# Altium schematic sheet radio.SchDoc
size A4; SheetNumber: 1; SheetTotal: 1
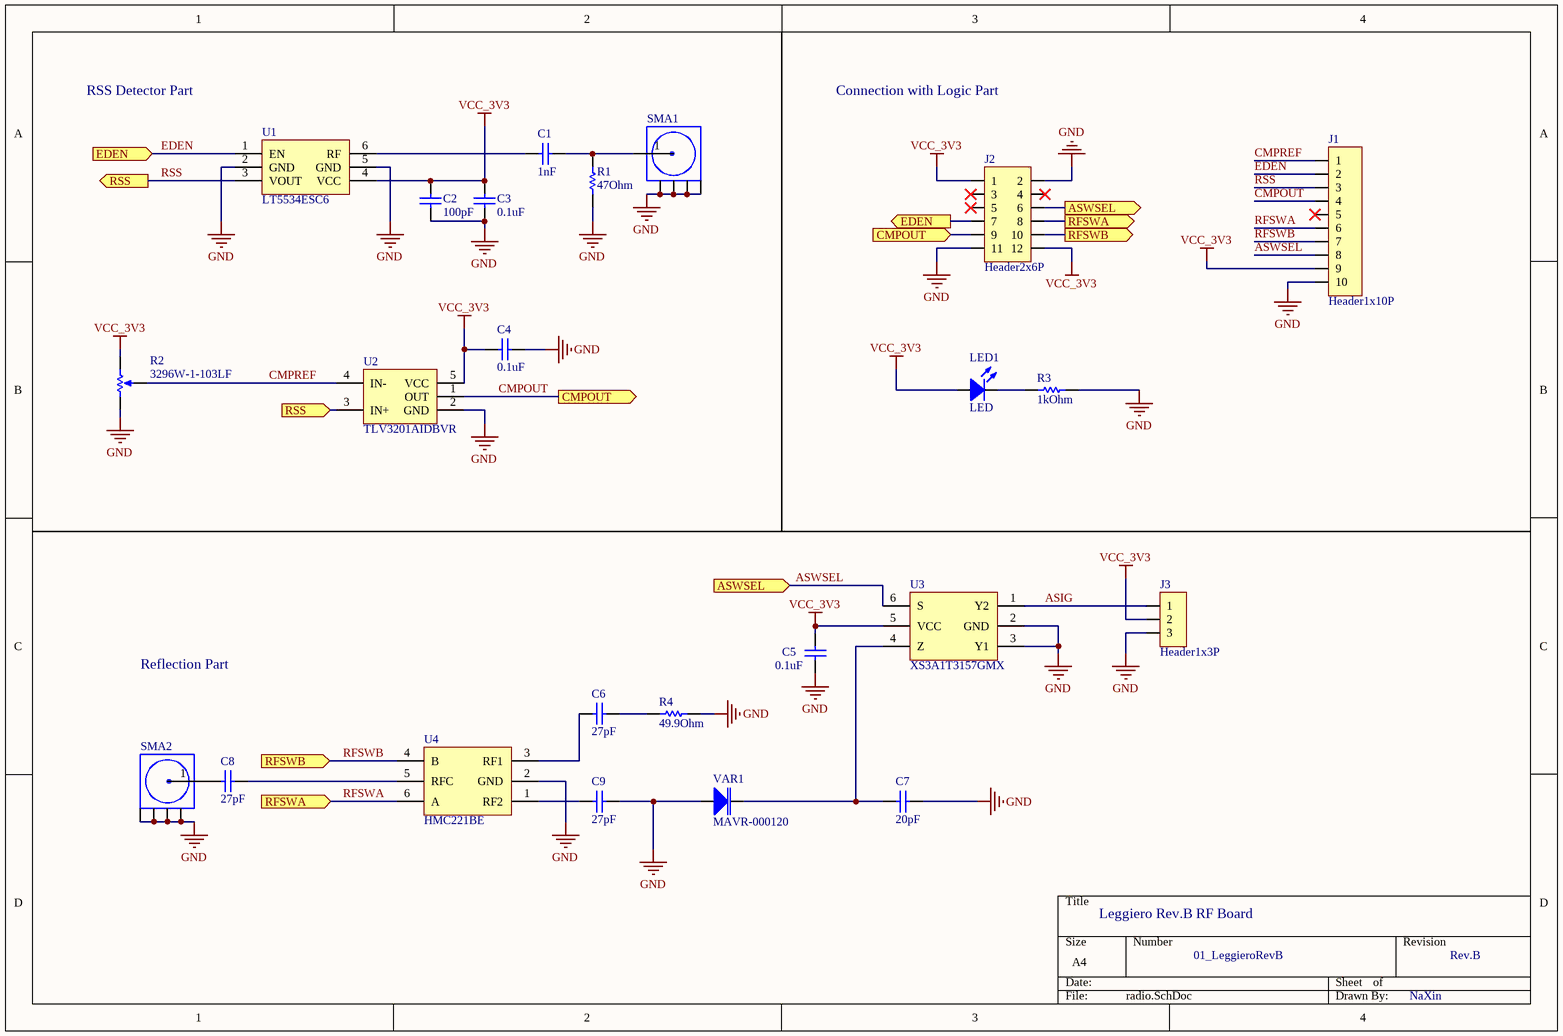
[diagram p0: radio.SchDoc]

## Parts
C1  1nF  [C0402]
C2  100pF  [C0603]
C3  0.1uF  [C0402]
C4  0.1uF  [C0402]
C5  0.1uF  [C0402]
C6  27pF  [C0402]
C7  20pF  [C0402]
C8  27pF  [C0402]
C9  27pF  [C0402]
J1  Header1x10P  [Header1x10P]
J2  Header2x6P  [Header2x6P]
J3  Header1x3P  [Header1x3P]
LED1  LED  [LED0603]
R1  47Ohm  [R0402]
R2  3296W-1-103LF  [3296W-1-103LF]
R3  1kOhm  [R0402]
R4  49.9Ohm  [R0402]
SMA1  RF2203017  [RF2203017]  (value not drawn)
SMA2  RF2203017  [RF2203017]  (value not drawn)
U1  LT5534ESC6  [LT5534ESC6#TRPBF]
U2  TLV3201AIDBVR  [TLV3201AIDBVR]
U3  XS3A1T3157GMX  [XSON6_115]
U4  HMC221BE  [SOT-23-6]
VAR1  MAVR-000120  [D0201]

## Ports
ASWSEL (in, see radio[3A]), ASWSEL (out, see radio[2C]), CMPOUT (in, see radio[2B]), CMPOUT (out, see radio[3A]), EDEN (in, see radio[3A]), EDEN (out, see radio[1A]), RFSWA (in, see radio[3A]), RFSWA (out, see radio[1D]), RFSWB (in, see radio[3A]), RFSWB (out, see radio[1C]), RSS (in, see radio[1A]), RSS (out, see radio[1B])

## Nets
GND: C2.1 C3.1 C4.1 C5.2 C7.2 C9.2 J1.10 J2.2 J2.11 J3.3 R1.1 R2.3(CW) R3.1 R4.1 SMA1.2(GND) SMA1.3(GND) SMA1.4(GND) SMA1.5(GND) SMA2.2(GND) SMA2.3(GND) SMA2.4(GND) SMA2.5(GND) U1.2(GND) U1.5(GND) U2.2(GND) U3.2(GND) U3.3(Y1) U4.2(GND) VAR1.2(A)
VCC_3V3: C2.2 C3.2 C4.2 C5.1 J1.9 J2.1 J2.12 J3.2 LED1.1 R2.1(CCW) U1.4(VCC) U2.5(VCC) U3.5(VCC)
ASIG: J3.1 U3.1(Y2)
ASWSEL: J1.8 J2.6 U3.6(S) ; port ASWSEL
CMPOUT: J1.4 J2.9 U2.1(OUT) ; port CMPOUT
CMPREF: J1.1 R2.2(WIPER) U2.4(IN-)
EDEN: J1.2 J2.7 U1.1(EN) ; port EDEN
RFSWA: J1.6 J2.8 U4.6(A) ; port RFSWA
RFSWB: J1.7 J2.10 U4.4(B) ; port RFSWB
RSS: J1.3 U1.3(VOUT) U2.3(IN+) ; port RSS
NetC1_1: C1.1 U1.6(RF)
NetC1_2: C1.2 R1.2 SMA1.1(SIG)
NetC6_1: C6.1 U4.3(RF1)
NetC6_2: C6.2 R4.2
NetC7_1: C7.1 U3.4(Z) VAR1.1(K)
NetC8_1: C8.1 SMA2.1(SIG)
NetC8_2: C8.2 U4.5(RFC)
NetC9_1: C9.1 U4.1(RF2)
NetLED1_2: LED1.2 R3.2

Not connected (* = marked no-connect by the designer): J1 5*; J2 3* 4* 5*

## Notes on the sheet
- RSS Detector Part
- Connection with Logic Part
- Reflection Part
- Leggiero Rev.B RF Board
- 01_LeggieroRevB
- Rev.B
- NaXin

## Library data of the parts
C1 = Cap: C597016
C2-C5 C7 = Cap
C6 C8 C9 = Cap: C88883
J1 = Header1x10P: C5156617
J2 = Header2x6P: C92269
J3 = Header1x3P: C7430359
R1 = Res: C491103
R2 = 3296W-1-103LF: C34846
R3 = Res
R4 = Res: C851030
SMA1 SMA2 = RF2203017: C2982575
U1 = LT5534ESC6: C459867
U2 = TLV3201AIDBVR: C105188
U3 = XS3A1T3157GMX: C3657276
U4 = HMC221BE: C1526247
VAR1 = MAVR-000120: C5139746